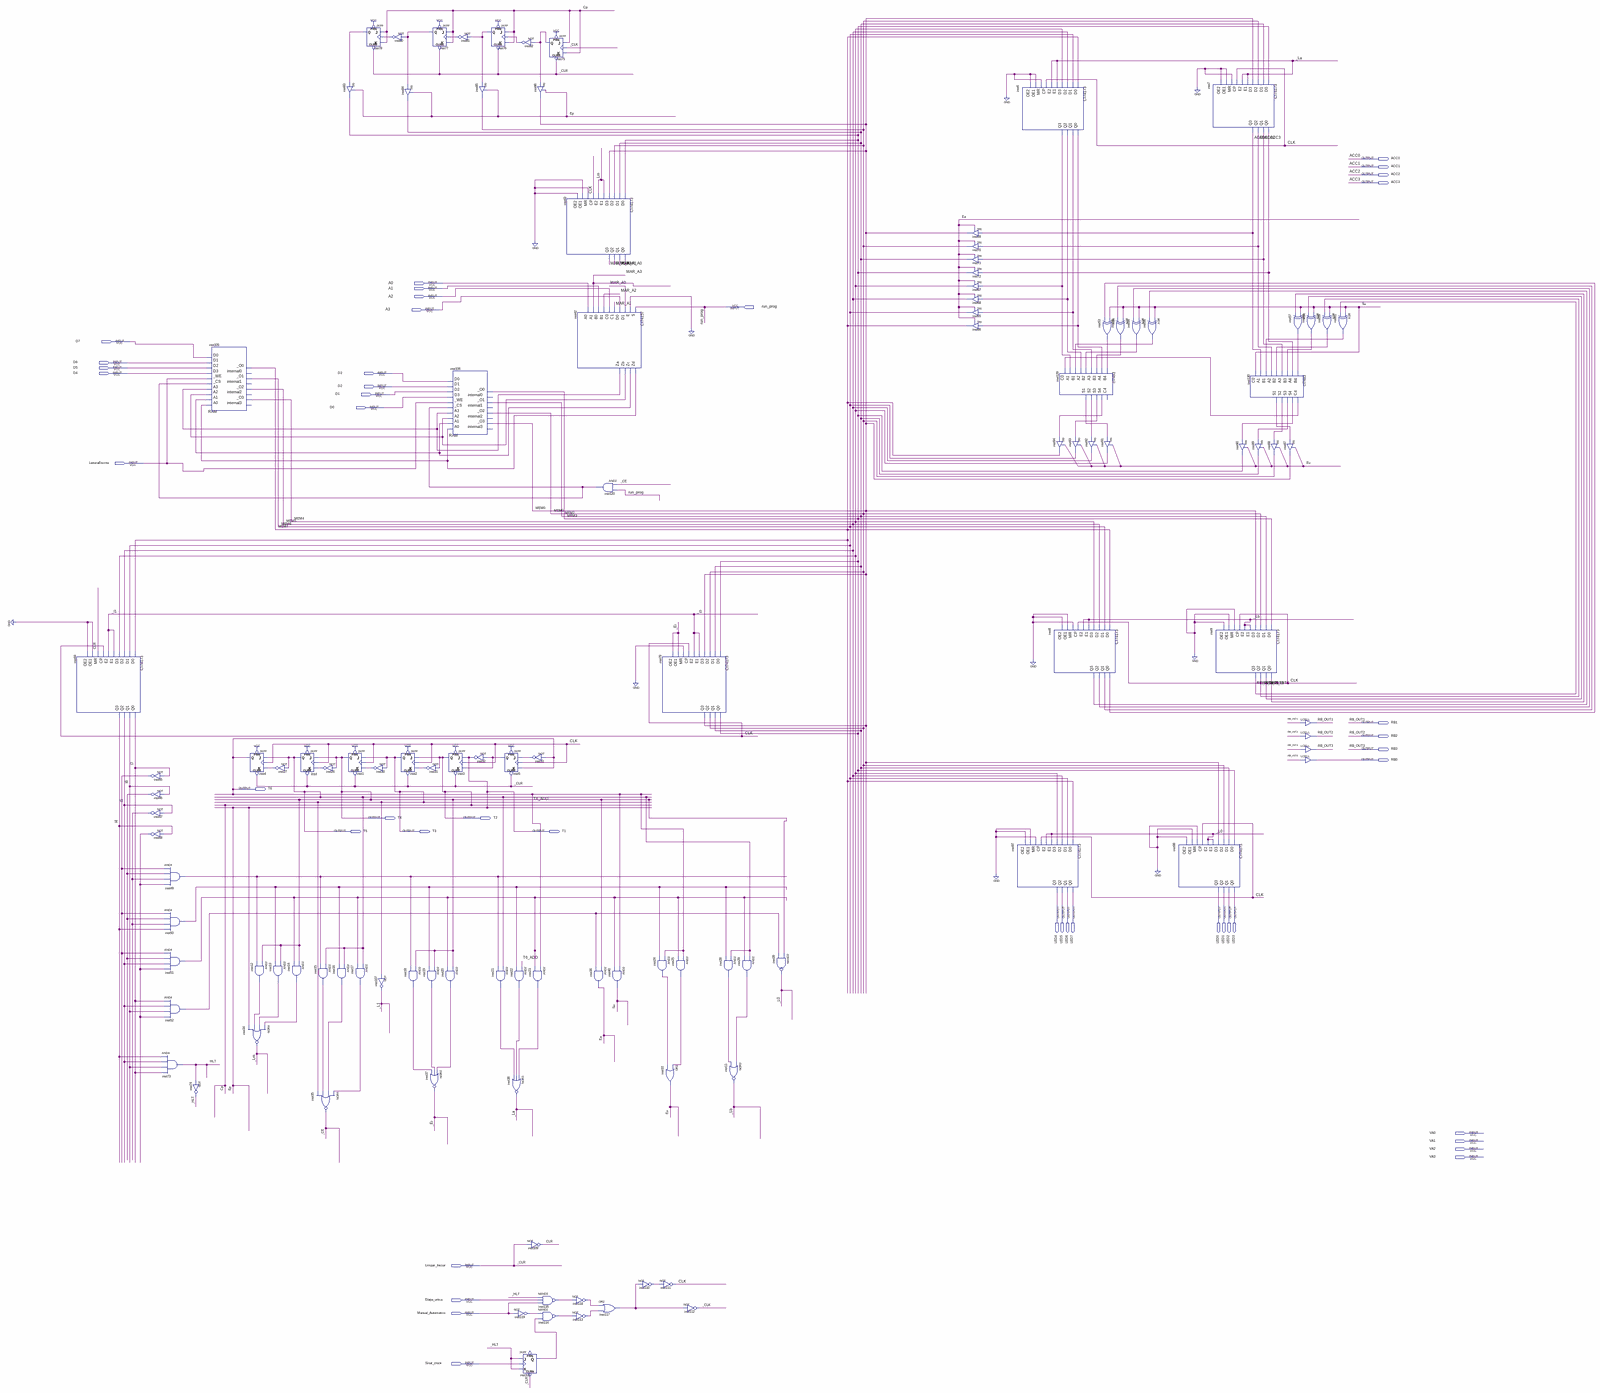
[diagram p0: schematic sheet, whole]
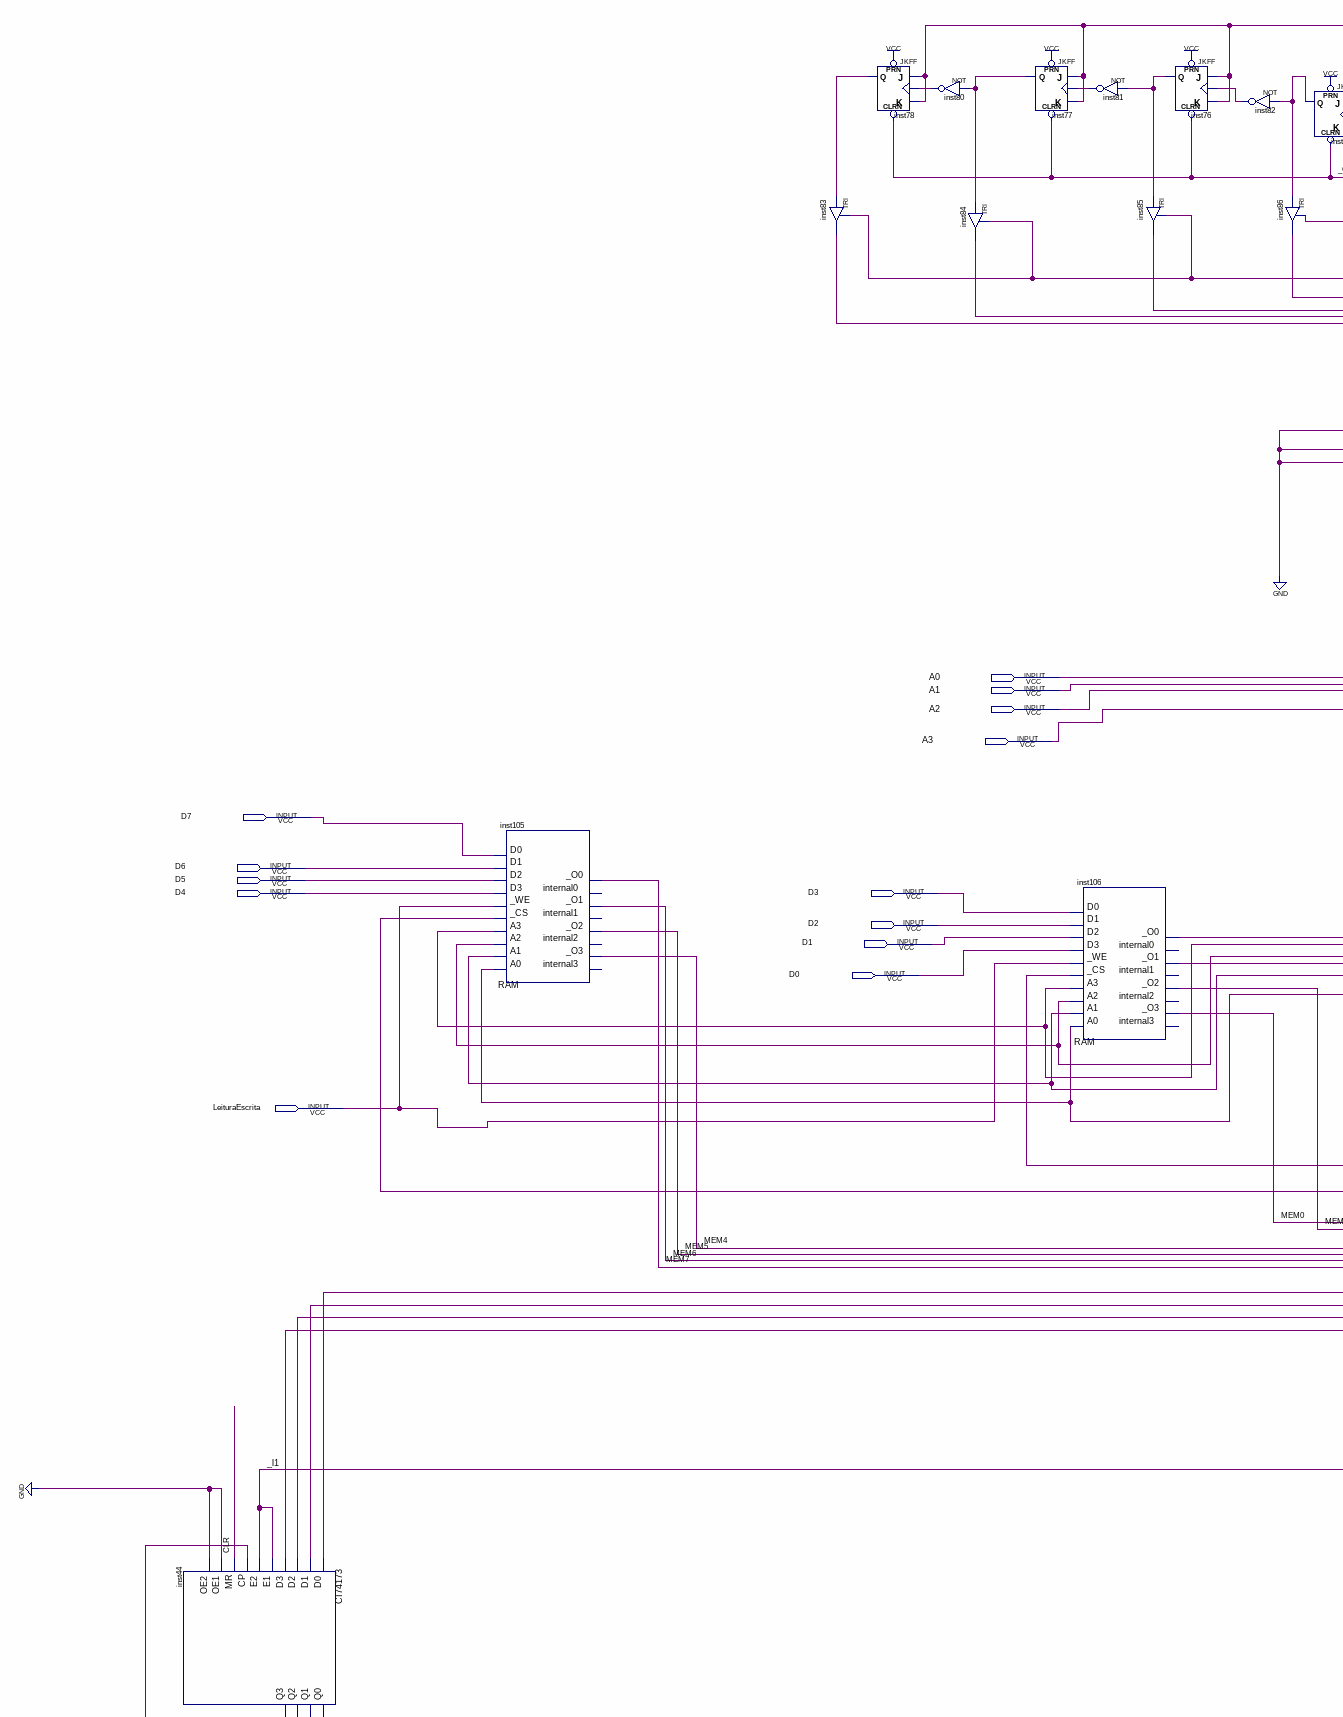
[diagram p1: schematic sheet, upper left part]
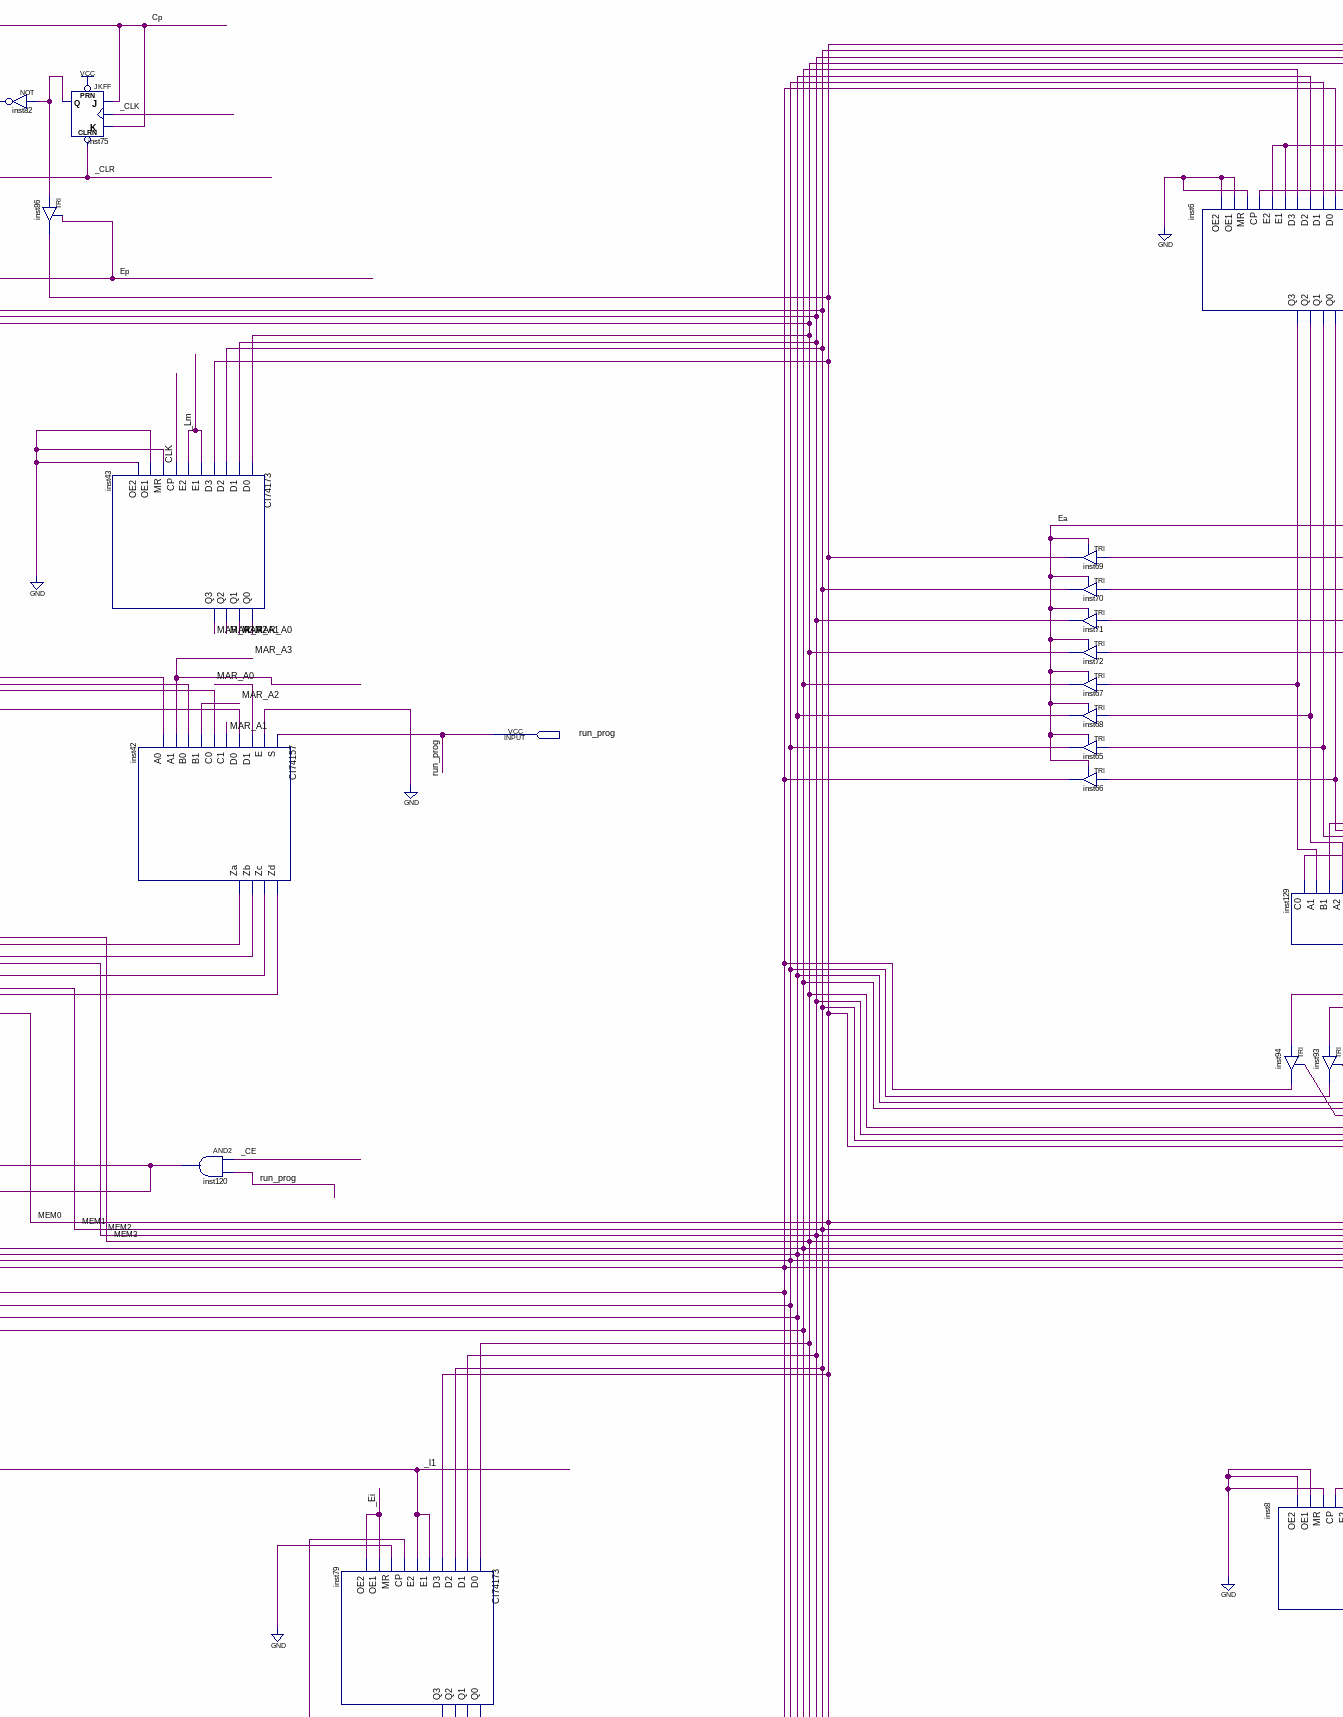
[diagram p2: schematic sheet, upper centre part]
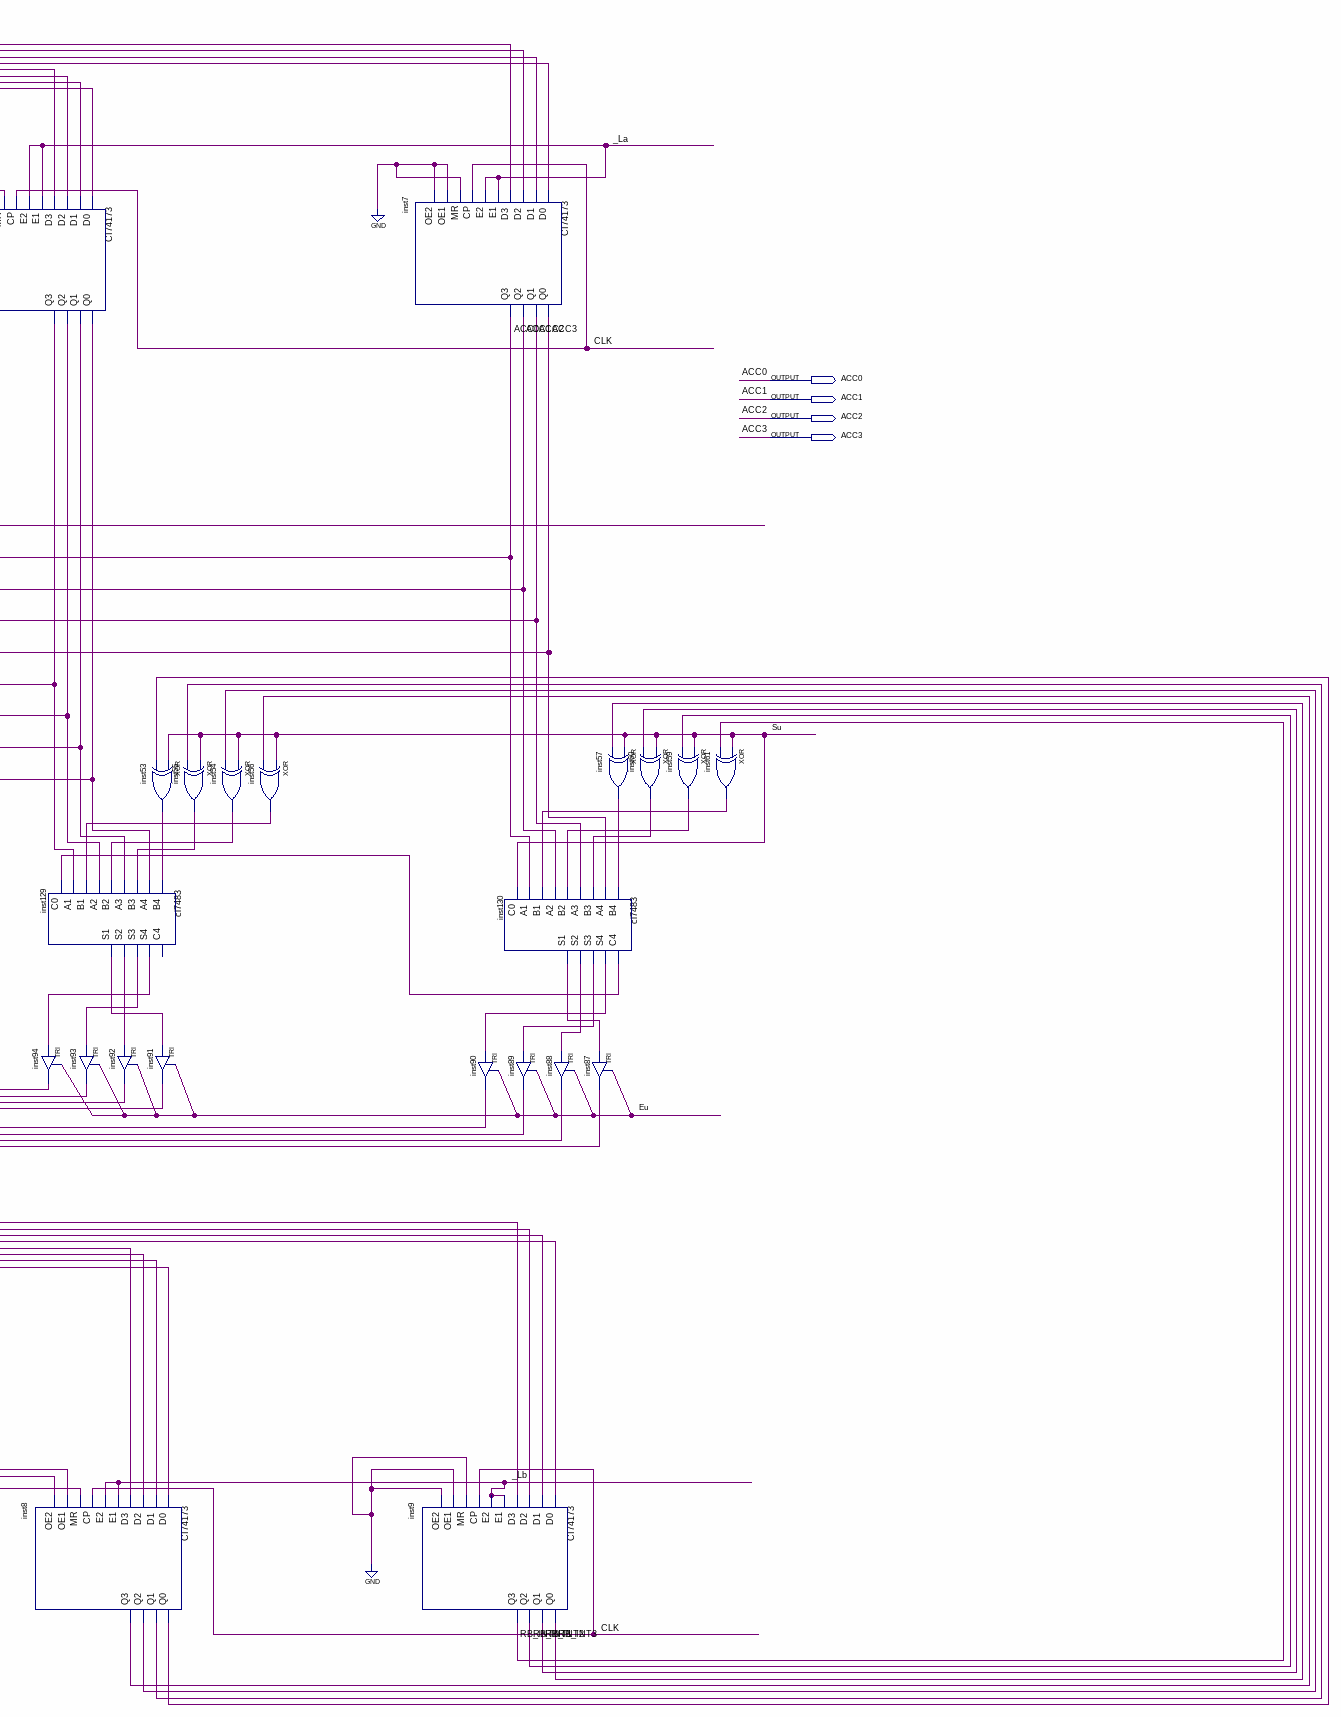
[diagram p3: schematic sheet, upper right part]
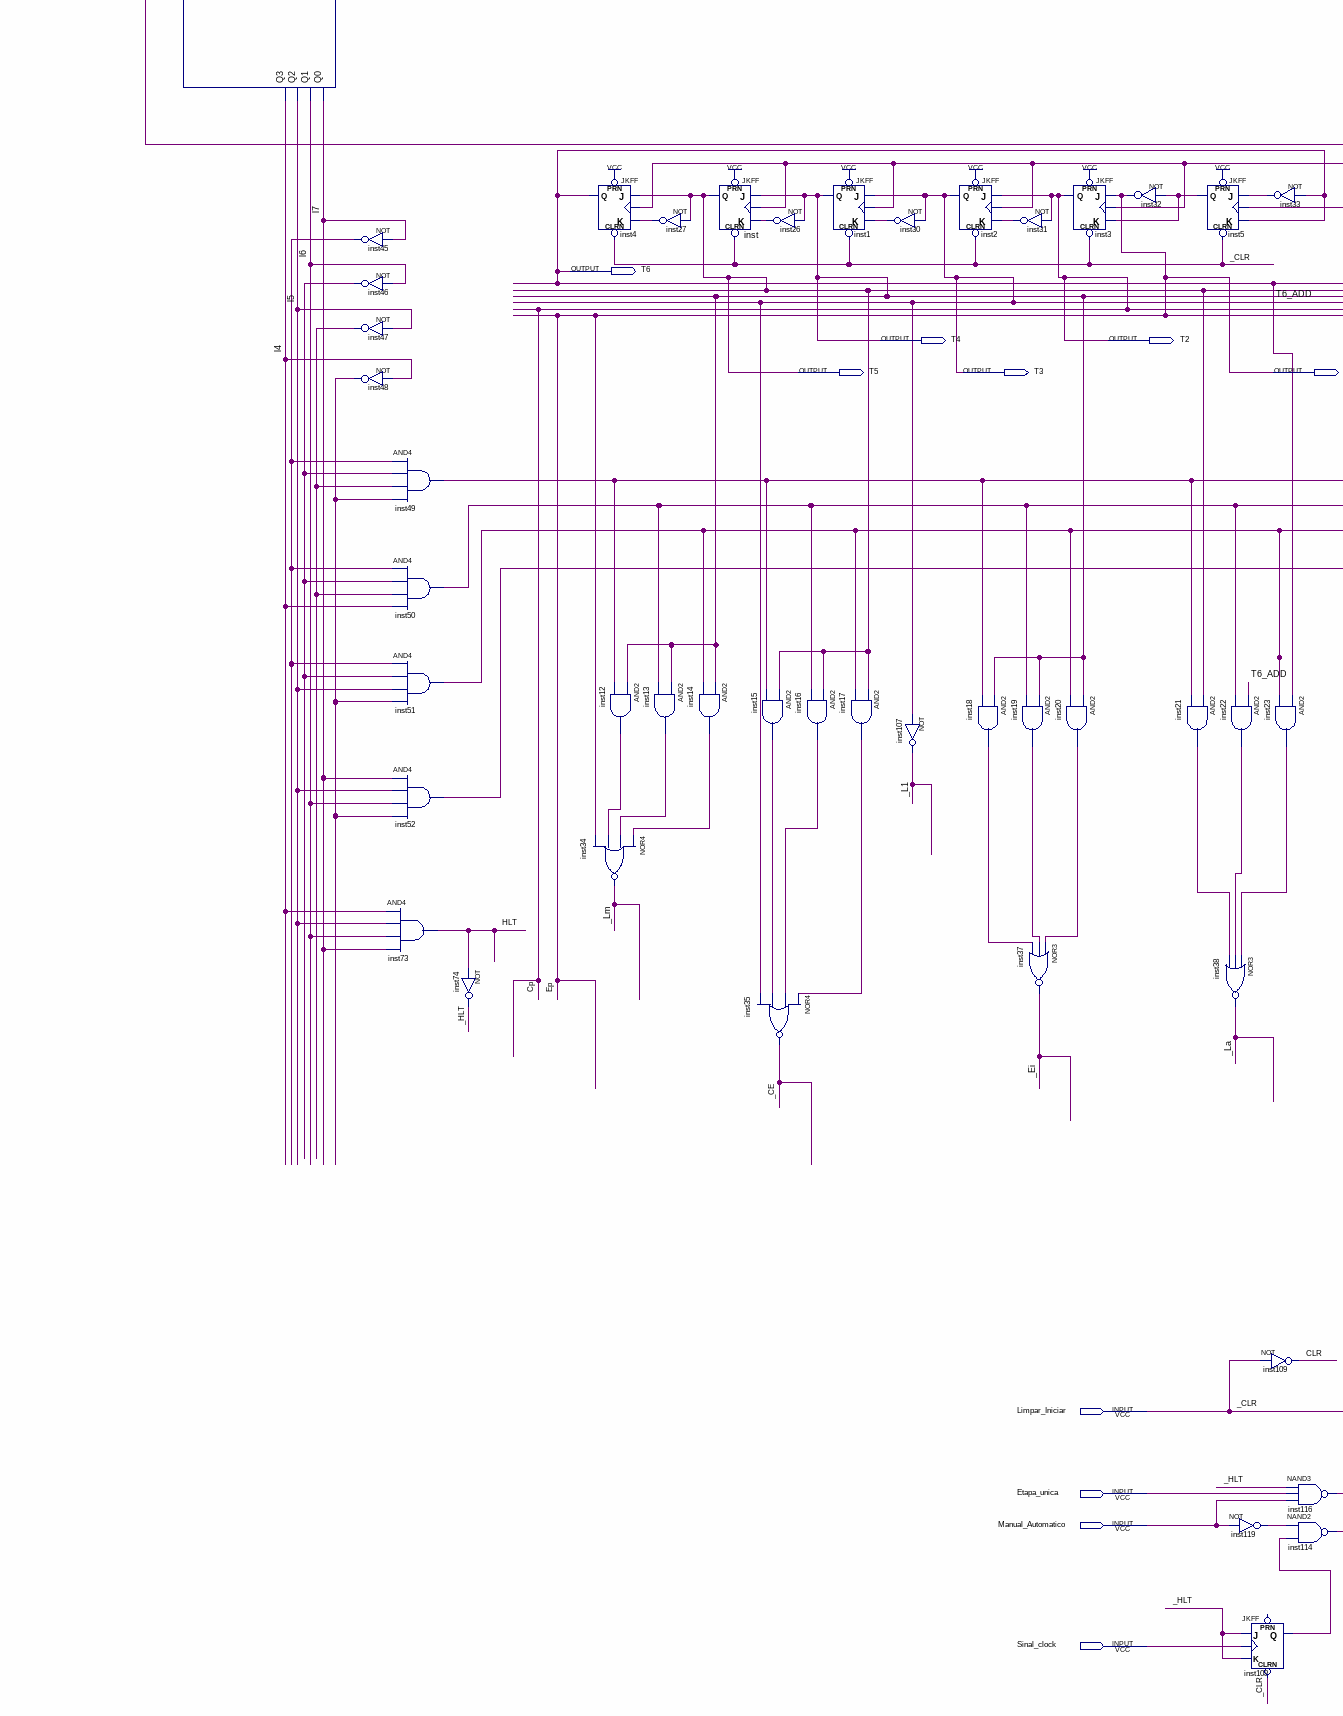
[diagram p4: schematic sheet, lower left part]
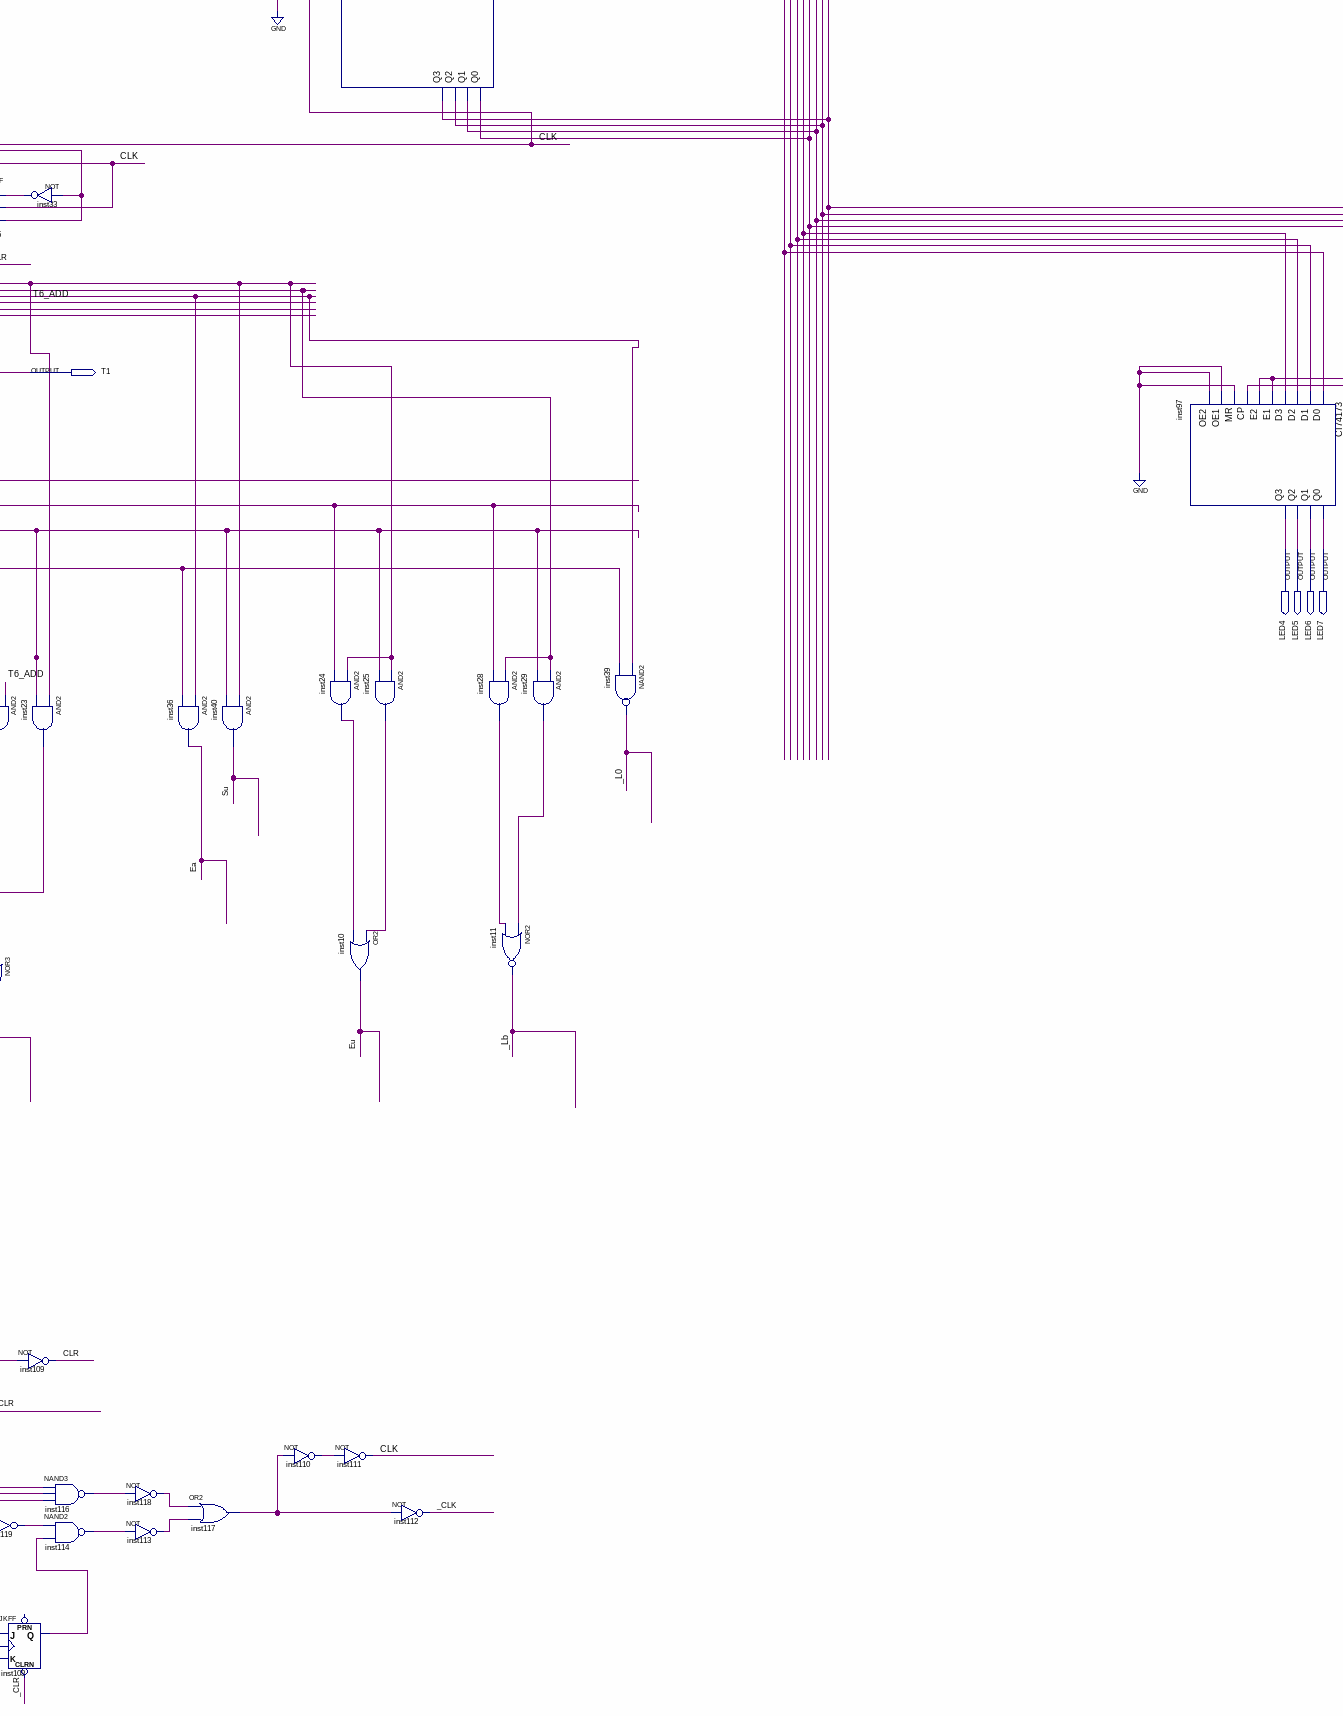
[diagram p5: schematic sheet, lower centre part]
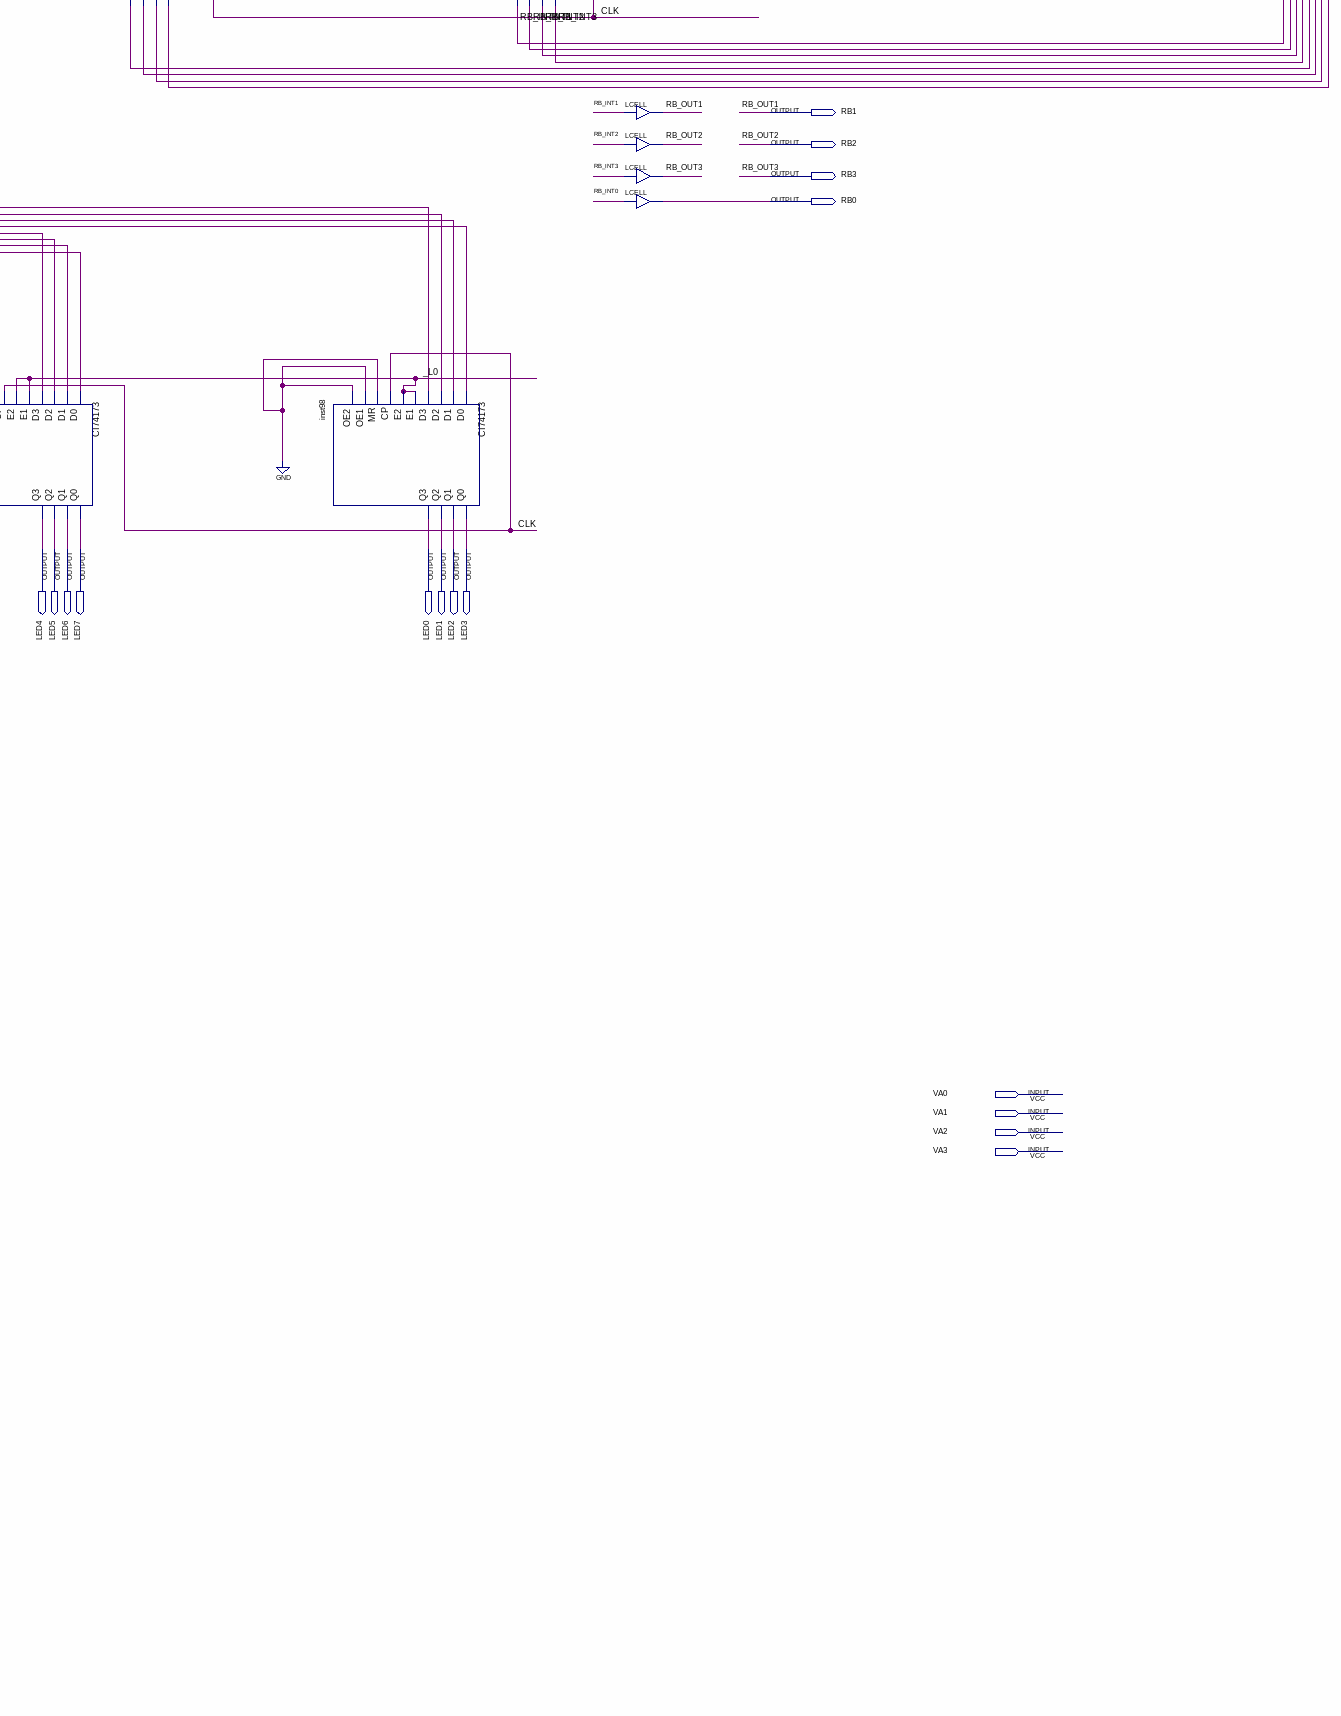
[diagram p6: schematic sheet, lower right part]
// Quartus schematic SAP1.bdf as structural Verilog: 113 symbols, 44 pins
module SAP1 (
  input  A0,
  input  A1,
  input  A2,
  input  run_prog,
  input  A3,
  input  D7,
  input  D6,
  input  D5,
  input  D4,
  input  D3,
  input  D2,
  input  D1,
  input  D0,
  input  LeituraEscrita,
  input  VA0,
  input  VA1,
  input  VA2,
  input  VA3,
  input  Limpar_Iniciar,
  input  Etapa_unica,
  input  Manual_Automatico,
  input  Sinal_clock,
  output ACC0,
  output ACC1,
  output ACC2,
  output ACC3,
  output RB1,
  output RB2,
  output RB3,
  output RB0,
  output T6,
  output T4,
  output T2,
  output T5,
  output T3,
  output T1,
  output LED4,
  output LED5,
  output LED6,
  output LED7,
  output LED0,
  output LED1,
  output LED2,
  output LED3
);

  wire _CE, _CLK, _Ei, _HLT, _L0, _L1, _La, _Lb, _Lm, CLK, CLR, Ea, Eu, HLT, inst5_q, inst6_q0, inst6_q1,
       inst6_q2, inst6_q3, inst8_q0, inst8_q1, inst8_q2, inst8_q3, inst12_out, inst13_out, inst14_out,
       inst15_out, inst16_out, inst17_out, inst18_out, inst19_out, inst20_out, inst21_out, inst22_out,
       inst23_out, inst24_out, inst25_out, inst26_out, inst27_out, inst28_out, inst29_out, inst30_out,
       inst31_out, inst33_out, inst42_za, inst42_zb, inst42_zc, inst42_zd, inst45_out, inst46_out,
       inst47_out, inst48_out, inst49_out, inst50_out, inst51_out, inst52_out, inst53_out, inst54_out,
       inst55_out, inst56_out, inst57_out, inst59_out, inst60_out, inst61_out, inst75_q, inst76_q, inst77_q,
       inst78_q, inst80_out, inst81_out, inst82_out, inst108_q, inst110_out, inst113_out, inst114_out,
       inst116_out, inst117_out, inst118_out, inst119_out, inst120_out, inst129_s1, inst129_s2, inst129_s3,
       inst129_s4, inst130_c4, inst130_s1, inst130_s2, inst130_s3, inst130_s4, l4, l5, l6, l7, MAR_A0,
       MAR_A1, MAR_A2, MAR_A3, MEM0, MEM1, MEM2, MEM3, MEM4, MEM5, MEM6, MEM7, RB_INT0, RB_INT1, RB_INT2,
       RB_INT3, Su;

  CI74173 inst44 (
    .D0(MEM7), .D1(MEM6), .D2(MEM5), .D3(MEM4), .E1(_L1), .E2(_L1), .CP(CLK), .MR(CLR), .OE1(1'b0),
    .OE2(1'b0), .Q0(l7), .Q1(l6), .Q2(l5), .Q3(l4));
  not inst45 (inst45_out, l7);
  not inst46 (inst46_out, l6);
  not inst47 (inst47_out, l5);
  not inst48 (inst48_out, l4);
  and inst49 (inst49_out, inst45_out, inst46_out, inst47_out, inst48_out);
  and inst50 (inst50_out, inst45_out, inst46_out, inst47_out, l4);
  and inst51 (inst51_out, inst45_out, inst46_out, l5, inst48_out);
  and inst52 (inst52_out, l7, l5, l6, inst48_out);
  and inst73 (HLT, l4, l5, l6, l7);
  RAM inst105 (
    .A0(inst42_zd), .A1(inst42_zc), .A2(inst42_zb), .A3(inst42_za), ._CS(inst120_out), ._WE(LeituraEscrita),
    .D3(D4), .D2(D5), .D1(D6), .D0(D7), ._O3(MEM4), ._O2(MEM5), ._O1(MEM6), ._O0(MEM7));  // open: internal3, internal2, internal1, internal0
  not inst74 (_HLT, HLT);
  JKFF inst4 (.PRN(1'b1), .CLRN(Limpar_Iniciar), .K(inst27_out), .J(T5), .CLK(CLK), .Q(T6));
  nor inst34 (_Lm, inst14_out, inst13_out, inst12_out, T1);
  and inst12 (inst12_out, T4, inst49_out);
  and inst13 (inst13_out, T4, inst50_out);
  not inst27 (inst27_out, T5);
  and inst14 (inst14_out, T4, inst51_out);
  JKFF inst (.PRN(1'b1), .CLRN(Limpar_Iniciar), .K(inst26_out), .J(T4), .CLK(CLK), .Q(T5));
  nor inst35 (_CE, inst17_out, inst16_out, inst15_out, T3);
  not inst26 (inst26_out, T4);
  and inst15 (inst15_out, T5, inst49_out);
  and inst16 (inst16_out, T5, inst50_out);
  TRI inst83 (.IN(inst78_q), .OE(T1), .OUT(MEM3));
  JKFF inst1 (.PRN(1'b1), .CLRN(Limpar_Iniciar), .K(inst30_out), .J(T3), .CLK(CLK), .Q(T4));
  and inst17 (inst17_out, T5, inst51_out);
  JKFF inst78 (.PRN(1'b1), .CLRN(Limpar_Iniciar), .K(T2), .J(T2), .CLK(inst80_out), .Q(inst78_q));
  not inst30 (inst30_out, T3);
  not inst107 (_L1, T3);
  not inst80 (inst80_out, inst77_q);
  JKFF inst2 (.PRN(1'b1), .CLRN(Limpar_Iniciar), .K(inst31_out), .J(T2), .CLK(CLK), .Q(T3));
  TRI inst84 (.IN(inst77_q), .OE(T1), .OUT(MEM2));
  and inst18 (inst18_out, T4, inst49_out);
  JKFF inst77 (.PRN(1'b1), .CLRN(Limpar_Iniciar), .K(T2), .J(T2), .CLK(inst81_out), .Q(inst77_q));
  not inst31 (inst31_out, T2);
  and inst19 (inst19_out, T4, inst50_out);
  nor inst37 (_Ei, inst20_out, inst19_out, inst18_out);
  not inst81 (inst81_out, inst76_q);
  RAM inst106 (
    .A0(inst42_zd), .A1(inst42_zc), .A2(inst42_zb), .A3(inst42_za), ._CS(inst120_out), ._WE(LeituraEscrita),
    .D3(D0), .D2(D1), .D1(D2), .D0(D3), ._O3(MEM0), ._O2(MEM1), ._O1(MEM2), ._O0(MEM3));  // open: internal3, internal2, internal1, internal0
  JKFF inst3 (.PRN(1'b1), .CLRN(Limpar_Iniciar), .K(inst5_q), .J(T1), .CLK(CLK), .Q(T2));
  and inst20 (inst20_out, T4, inst51_out);
  TRI inst85 (.IN(inst76_q), .OE(T1), .OUT(MEM1));
  not inst32 (T1, inst5_q);
  JKFF inst76 (.PRN(1'b1), .CLRN(Limpar_Iniciar), .K(T2), .J(T2), .CLK(inst82_out), .Q(inst76_q));
  JKFF inst5 (.PRN(1'b1), .CLRN(Limpar_Iniciar), .K(T6), .J(inst33_out), .CLK(CLK), .Q(inst5_q));
  and inst21 (inst21_out, T5, inst49_out);
  not inst82 (inst82_out, inst75_q);
  and inst22 (inst22_out, T6, inst50_out);
  nor inst38 (_La, inst23_out, inst22_out, inst21_out);
  not inst119 (inst119_out, Manual_Automatico);
  JKFF inst108 (.CLRN(Limpar_Iniciar), .K(_HLT), .J(_HLT), .CLK(Sinal_clock), .Q(inst108_q));  // open: PRN
  JKFF inst75 (.PRN(1'b1), .CLRN(Limpar_Iniciar), .K(T2), .J(T2), .CLK(_CLK), .Q(inst75_q));
  TRI inst86 (.IN(inst75_q), .OE(T1), .OUT(MEM0));
  not inst33 (inst33_out, T6);
  and inst23 (inst23_out, T6, inst51_out);
  not inst109 (CLR, Limpar_Iniciar);
  nand inst116 (inst116_out, _HLT, Etapa_unica, Manual_Automatico);
  nand inst114 (inst114_out, inst119_out, inst108_q);
  CI74173 inst43 (
    .D0(MEM3), .D1(MEM2), .D2(MEM1), .D3(MEM0), .E1(_Lm), .E2(_Lm), .CP(CLK), .MR(1'b0), .OE1(1'b0),
    .OE2(1'b0), .Q0(MAR_A0), .Q1(MAR_A1), .Q2(MAR_A2), .Q3(MAR_A3));
  CI74157 inst42 (
    .S(run_prog), .E(1'b0), .D1(MAR_A0), .D0(A3), .C1(MAR_A1), .C0(A2), .B1(MAR_A2), .B0(A1), .A1(MAR_A3),
    .A0(A0), .Zd(inst42_zd), .Zc(inst42_zc), .Zb(inst42_zb), .Za(inst42_za));
  not inst118 (inst118_out, inst116_out);
  not inst113 (inst113_out, inst114_out);
  and inst120 (inst120_out, _CE, run_prog);
  and inst36 (Ea, T4, inst52_out);
  and inst40 (Su, T6, inst51_out);
  or inst117 (inst117_out, inst118_out, inst113_out);
  not inst110 (inst110_out, inst117_out);
  CI74173 inst79 (
    .D0(MEM3), .D1(MEM2), .D2(MEM1), .D3(MEM0), .E1(_L1), .E2(_L1), .CP(CLK), .MR(1'b0), .OE1(_Ei),
    .OE2(_Ei), .Q0(MEM3), .Q1(MEM2), .Q2(MEM1), .Q3(MEM0));
  and inst24 (inst24_out, T6, inst50_out);
  and inst25 (inst25_out, T6, inst51_out);
  or inst10 (Eu, inst25_out, inst24_out);
  not inst111 (CLK, inst110_out);
  not inst112 (_CLK, inst117_out);
  and inst28 (inst28_out, T5, inst50_out);
  nor inst11 (_Lb, inst29_out, inst28_out);
  and inst29 (inst29_out, T5, inst51_out);
  nand inst39 (_L0, T4, inst52_out);
  TRI inst69 (.IN(ACC0), .OE(Ea), .OUT(MEM0));
  TRI inst70 (.IN(ACC1), .OE(Ea), .OUT(MEM1));
  TRI inst71 (.IN(ACC2), .OE(Ea), .OUT(MEM2));
  TRI inst72 (.IN(ACC3), .OE(Ea), .OUT(MEM3));
  TRI inst67 (.IN(inst6_q3), .OE(Ea), .OUT(MEM4));
  TRI inst68 (.IN(inst6_q2), .OE(Ea), .OUT(MEM5));
  TRI inst65 (.IN(inst6_q1), .OE(Ea), .OUT(MEM6));
  TRI inst66 (.IN(inst6_q0), .OE(Ea), .OUT(MEM7));
  CI74173 inst97 (
    .D0(MEM7), .D1(MEM6), .D2(MEM5), .D3(MEM4), .E1(_L0), .E2(_L0), .CP(CLK), .MR(1'b0), .OE1(1'b0),
    .OE2(1'b0), .Q0(LED7), .Q1(LED6), .Q2(LED5), .Q3(LED4));
  CI74173 inst6 (
    .D0(MEM7), .D1(MEM6), .D2(MEM5), .D3(MEM4), .E1(_La), .E2(_La), .CP(CLK), .MR(1'b0), .OE1(1'b0),
    .OE2(1'b0), .Q0(inst6_q0), .Q1(inst6_q1), .Q2(inst6_q2), .Q3(inst6_q3));
  ci7483 inst129 (
    .B4(inst53_out), .A4(inst6_q0), .B3(inst55_out), .A3(inst6_q1), .B2(inst54_out), .A2(inst6_q2),
    .B1(inst56_out), .A1(inst6_q3), .C0(inst130_c4), .S4(inst129_s4), .S3(inst129_s3), .S2(inst129_s2),
    .S1(inst129_s1));  // open: C4
  TRI inst94 (.IN(inst129_s4), .OE(Eu), .OUT(MEM7));
  CI74173 inst8 (
    .D0(MEM7), .D1(MEM6), .D2(MEM5), .D3(MEM4), .E1(_Lb), .E2(_Lb), .CP(CLK), .MR(1'b0), .OE1(1'b0),
    .OE2(1'b0), .Q0(inst8_q0), .Q1(inst8_q1), .Q2(inst8_q2), .Q3(inst8_q3));
  TRI inst93 (.IN(inst129_s3), .OE(Eu), .OUT(MEM6));
  TRI inst92 (.IN(inst129_s2), .OE(Eu), .OUT(MEM5));
  xor inst53 (inst53_out, Su, inst8_q0);
  xor inst55 (inst55_out, Su, inst8_q1);
  TRI inst91 (.IN(inst129_s1), .OE(Eu), .OUT(MEM4));
  xor inst54 (inst54_out, Su, inst8_q2);
  xor inst56 (inst56_out, Su, inst8_q3);
  CI74173 inst98 (
    .D0(MEM3), .D1(MEM2), .D2(MEM1), .D3(MEM0), .E1(_L0), .E2(_L0), .CP(CLK), .MR(1'b0), .OE1(1'b0),
    .OE2(1'b0), .Q0(LED3), .Q1(LED2), .Q2(LED1), .Q3(LED0));
  CI74173 inst7 (
    .D0(MEM3), .D1(MEM2), .D2(MEM1), .D3(MEM0), .E1(_La), .E2(_La), .CP(CLK), .MR(1'b0), .OE1(1'b0),
    .OE2(1'b0), .Q0(ACC3), .Q1(ACC2), .Q2(ACC1), .Q3(ACC0));
  CI74173 inst9 (
    .D0(MEM3), .D1(MEM2), .D2(MEM1), .D3(MEM0), .E1(_Lb), .E2(_Lb), .CP(CLK), .MR(1'b0), .OE1(1'b0),
    .OE2(1'b0), .Q0(RB_INT3), .Q1(RB_INT2), .Q2(RB_INT1), .Q3(RB_INT0));
  ci7483 inst130 (
    .B4(inst57_out), .A4(ACC3), .B3(inst60_out), .A3(ACC2), .B2(inst59_out), .A2(ACC1), .B1(inst61_out),
    .A1(ACC0), .C0(Su), .C4(inst130_c4), .S4(inst130_s4), .S3(inst130_s3), .S2(inst130_s2), .S1(inst130_s1));
  TRI inst90 (.IN(inst130_s4), .OE(Eu), .OUT(MEM3));
  TRI inst89 (.IN(inst130_s3), .OE(Eu), .OUT(MEM2));
  TRI inst88 (.IN(inst130_s2), .OE(Eu), .OUT(MEM1));
  TRI inst87 (.IN(inst130_s1), .OE(Eu), .OUT(MEM0));
  xor inst57 (inst57_out, Su, RB_INT3);
  xor inst60 (inst60_out, Su, RB_INT2);
  LCELL obs_rb1 (.IN(RB_INT1), .OUT(RB1));
  LCELL obs_rb2 (.IN(RB_INT2), .OUT(RB2));
  LCELL obs_rb3 (.IN(RB_INT3), .OUT(RB3));
  LCELL obs_rb0 (.IN(RB_INT0), .OUT(RB0));
  xor inst59 (inst59_out, Su, RB_INT1);
  xor inst61 (inst61_out, Su, RB_INT0);

  // Other names for the same wires on the sheet: Ep = T1; _CLR = Limpar_Iniciar; RB_OUT1 = RB1; RB_OUT2 = RB2;
  //   RB_OUT3 = RB3; Cp = T2; T6_ADD = T6
endmodule
